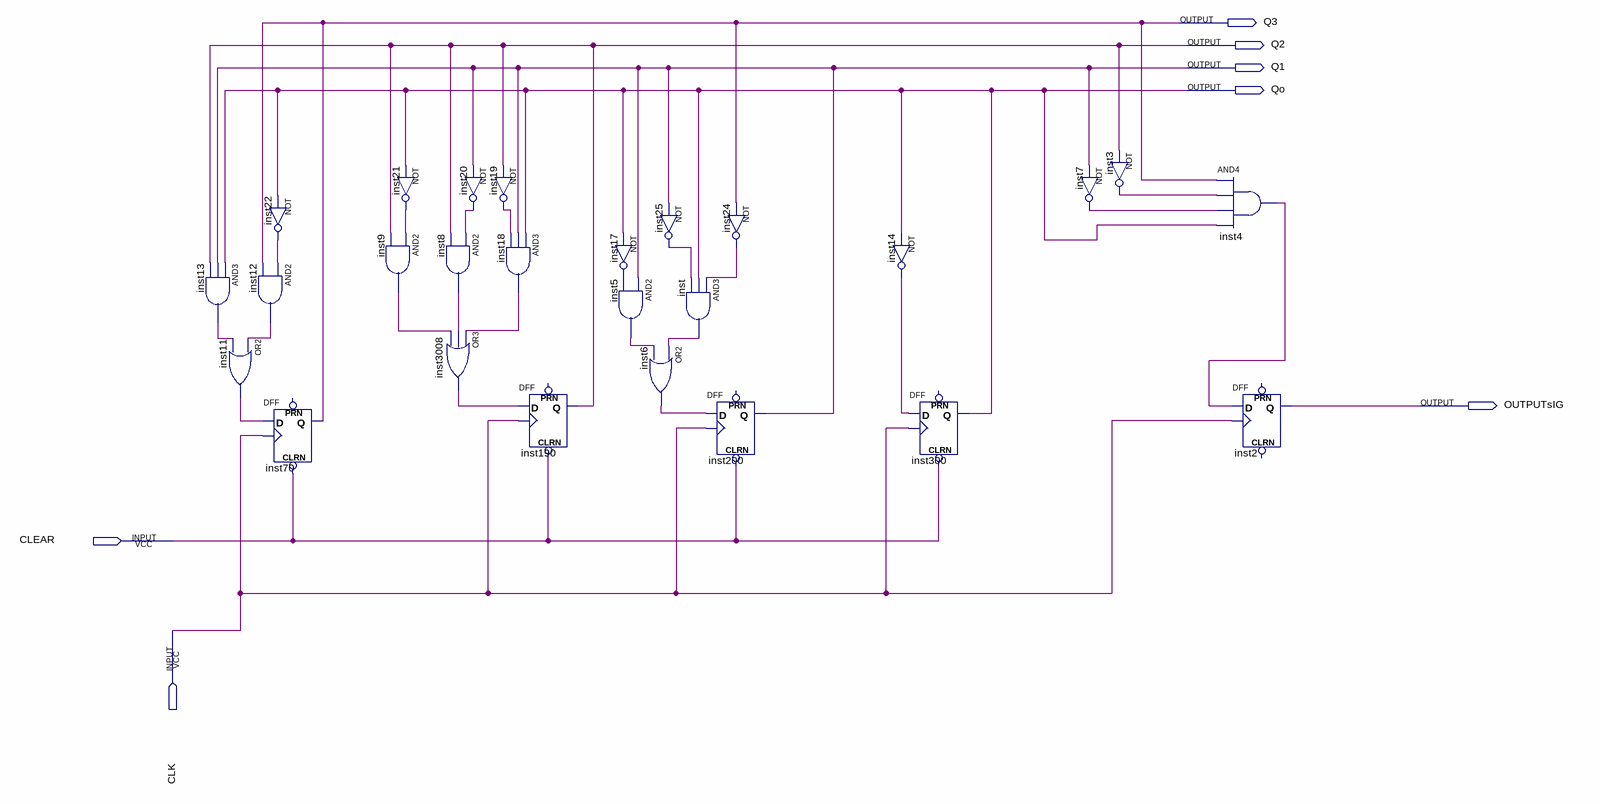
[diagram p0: schematic sheet]
// Quartus schematic mod_10_Lab6.bdf as structural Verilog: 26 symbols, 7 pins
module mod_10_Lab6 (
  input  CLEAR,
  input  CLK,
  output Q3,
  output Q2,
  output Q1,
  output Qo,
  output OUTPUTsIG
);

  wire inst3_out, inst4_out, inst5_out, inst6_out, inst7_out, inst8_out, inst9_out, inst11_out, inst12_out,
       inst13_out, inst14_out, inst17_out, inst18_out, inst19_out, inst20_out, inst21_out, inst22_out,
       inst24_out, inst25_out, inst3008_out, inst_out;

  and inst13 (inst13_out, Qo, Q1, Q2);
  or inst11 (inst11_out, inst12_out, inst13_out);
  not inst22 (inst22_out, Qo);
  and inst12 (inst12_out, inst22_out, Q3);
  DFF inst70 (.CLRN(CLEAR), .CLK(CLK), .D(inst11_out), .Q(Q3));  // open: PRN
  not inst21 (inst21_out, Qo);
  and inst9 (inst9_out, inst21_out, Q2);
  not inst20 (inst20_out, Q1);
  and inst8 (inst8_out, inst20_out, Q2);
  or inst3008 (inst3008_out, inst18_out, inst8_out, inst9_out);
  not inst19 (inst19_out, Q2);
  and inst18 (inst18_out, Qo, Q1, inst19_out);
  DFF inst190 (.CLRN(CLEAR), .CLK(CLK), .D(inst3008_out), .Q(Q2));  // open: PRN
  not inst25 (inst25_out, Q1);
  not inst17 (inst17_out, Qo);
  and inst5 (inst5_out, Q1, inst17_out);
  or inst6 (inst6_out, inst_out, inst5_out);
  and inst (inst_out, inst24_out, Qo, inst25_out);
  DFF inst200 (.CLRN(CLEAR), .CLK(CLK), .D(inst6_out), .Q(Q1));  // open: PRN
  not inst24 (inst24_out, Q3);
  not inst14 (inst14_out, Qo);
  DFF inst300 (.CLRN(CLEAR), .CLK(CLK), .D(inst14_out), .Q(Qo));  // open: PRN
  not inst7 (inst7_out, Q1);
  not inst3 (inst3_out, Q2);
  and inst4 (inst4_out, Q3, inst3_out, inst7_out, Qo);
  DFF inst2 (.CLK(CLK), .D(inst4_out), .Q(OUTPUTsIG));  // open: CLRN, PRN
endmodule
